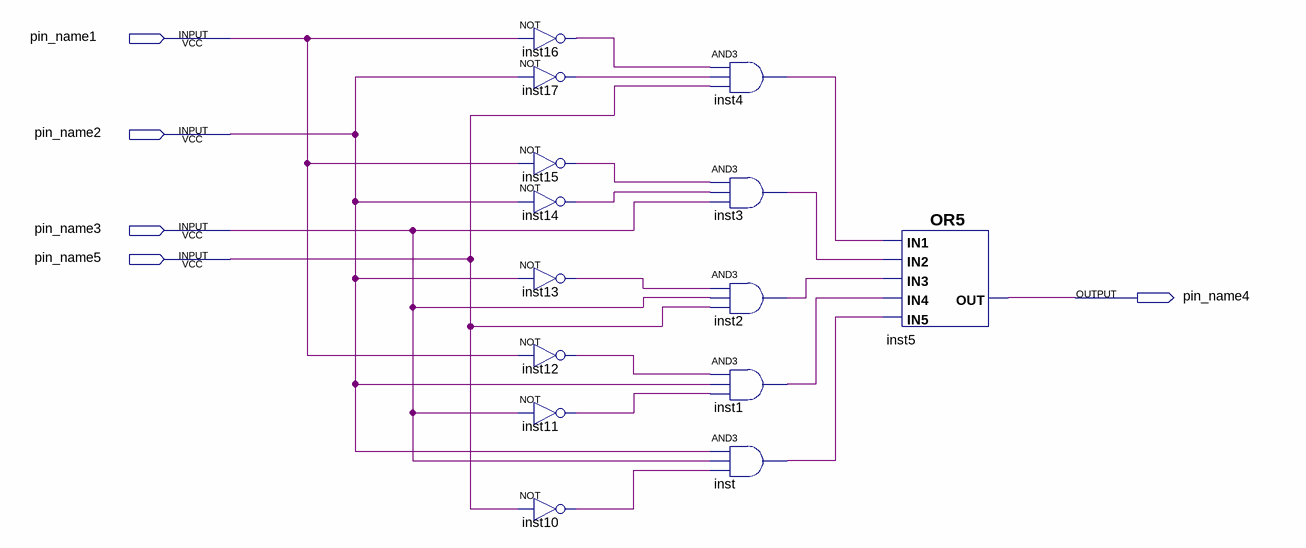
[diagram p0: schematic sheet]
// Quartus schematic C2.bdf as structural Verilog: 14 symbols, 5 pins
module C2 (
  input  pin_name1,
  input  pin_name2,
  input  pin_name3,
  input  pin_name5,
  output pin_name4
);

  wire inst1_out, inst2_out, inst3_out, inst4_out, inst10_out, inst11_out, inst12_out, inst13_out,
       inst14_out, inst15_out, inst16_out, inst17_out, inst_out;

  not inst16 (inst16_out, pin_name1);
  not inst17 (inst17_out, pin_name2);
  not inst15 (inst15_out, pin_name1);
  not inst14 (inst14_out, pin_name2);
  not inst13 (inst13_out, pin_name2);
  not inst12 (inst12_out, pin_name1);
  not inst11 (inst11_out, pin_name3);
  not inst10 (inst10_out, pin_name5);
  and inst4 (inst4_out, inst16_out, inst17_out, pin_name5);
  and inst3 (inst3_out, inst15_out, inst14_out, pin_name3);
  and inst2 (inst2_out, inst13_out, pin_name3, pin_name5);
  and inst1 (inst1_out, inst12_out, pin_name2, inst11_out);
  and inst (inst_out, pin_name2, pin_name3, inst10_out);
  or inst5 (pin_name4, inst4_out, inst3_out, inst2_out, inst1_out, inst_out);
endmodule
